# EAGLE board soundpuddle_megawing_mk2 (EAGLE 6.3), part 1 of 2
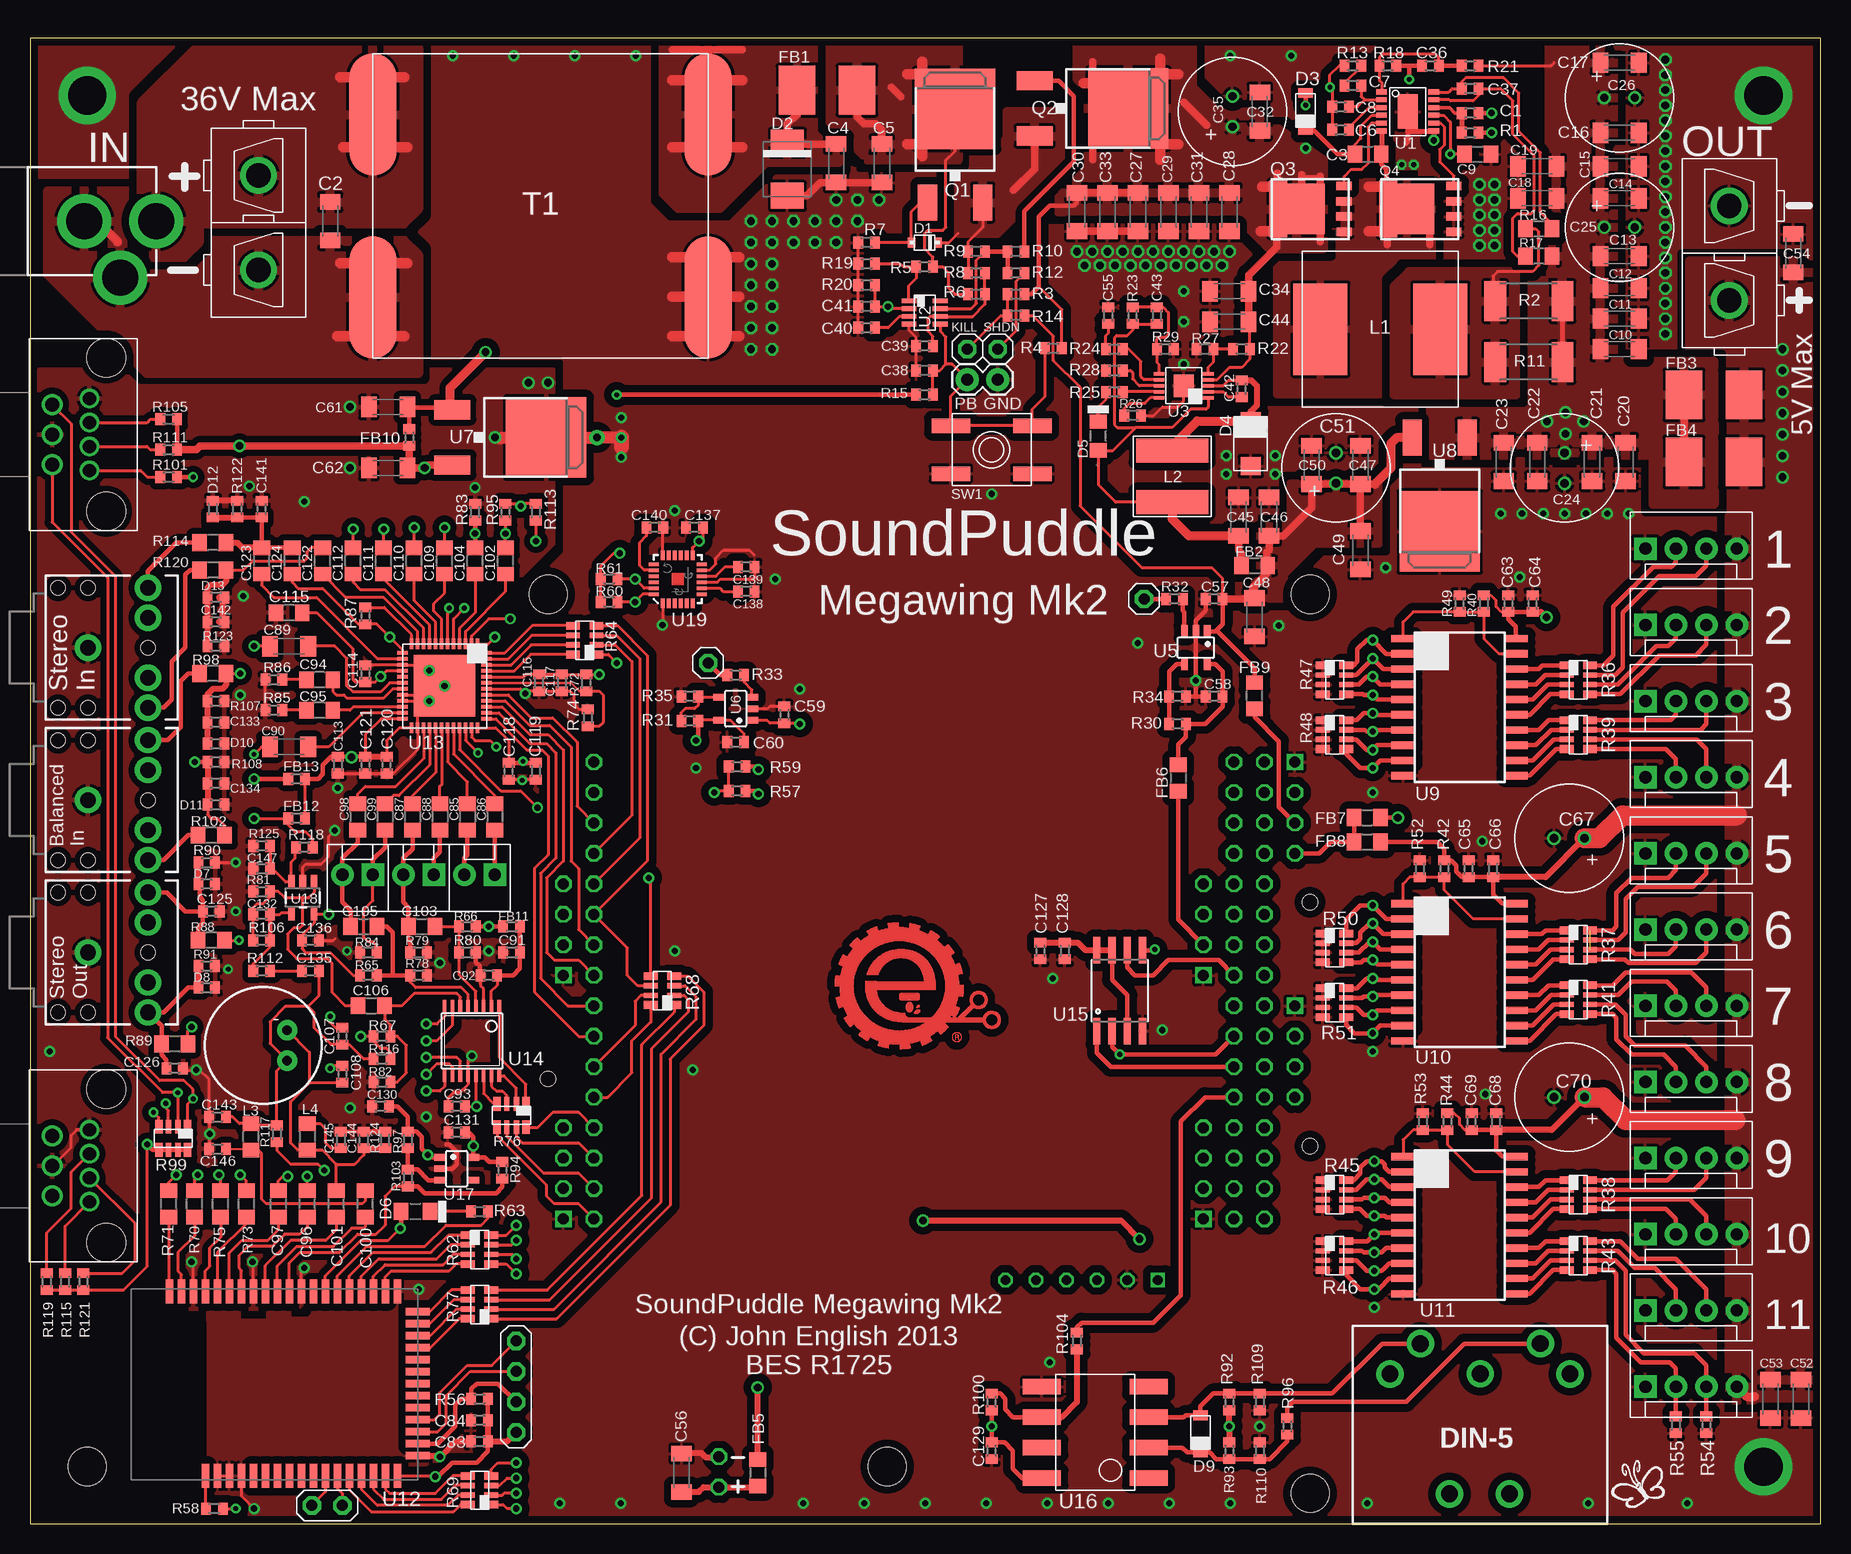
[diagram p5: board, top side]
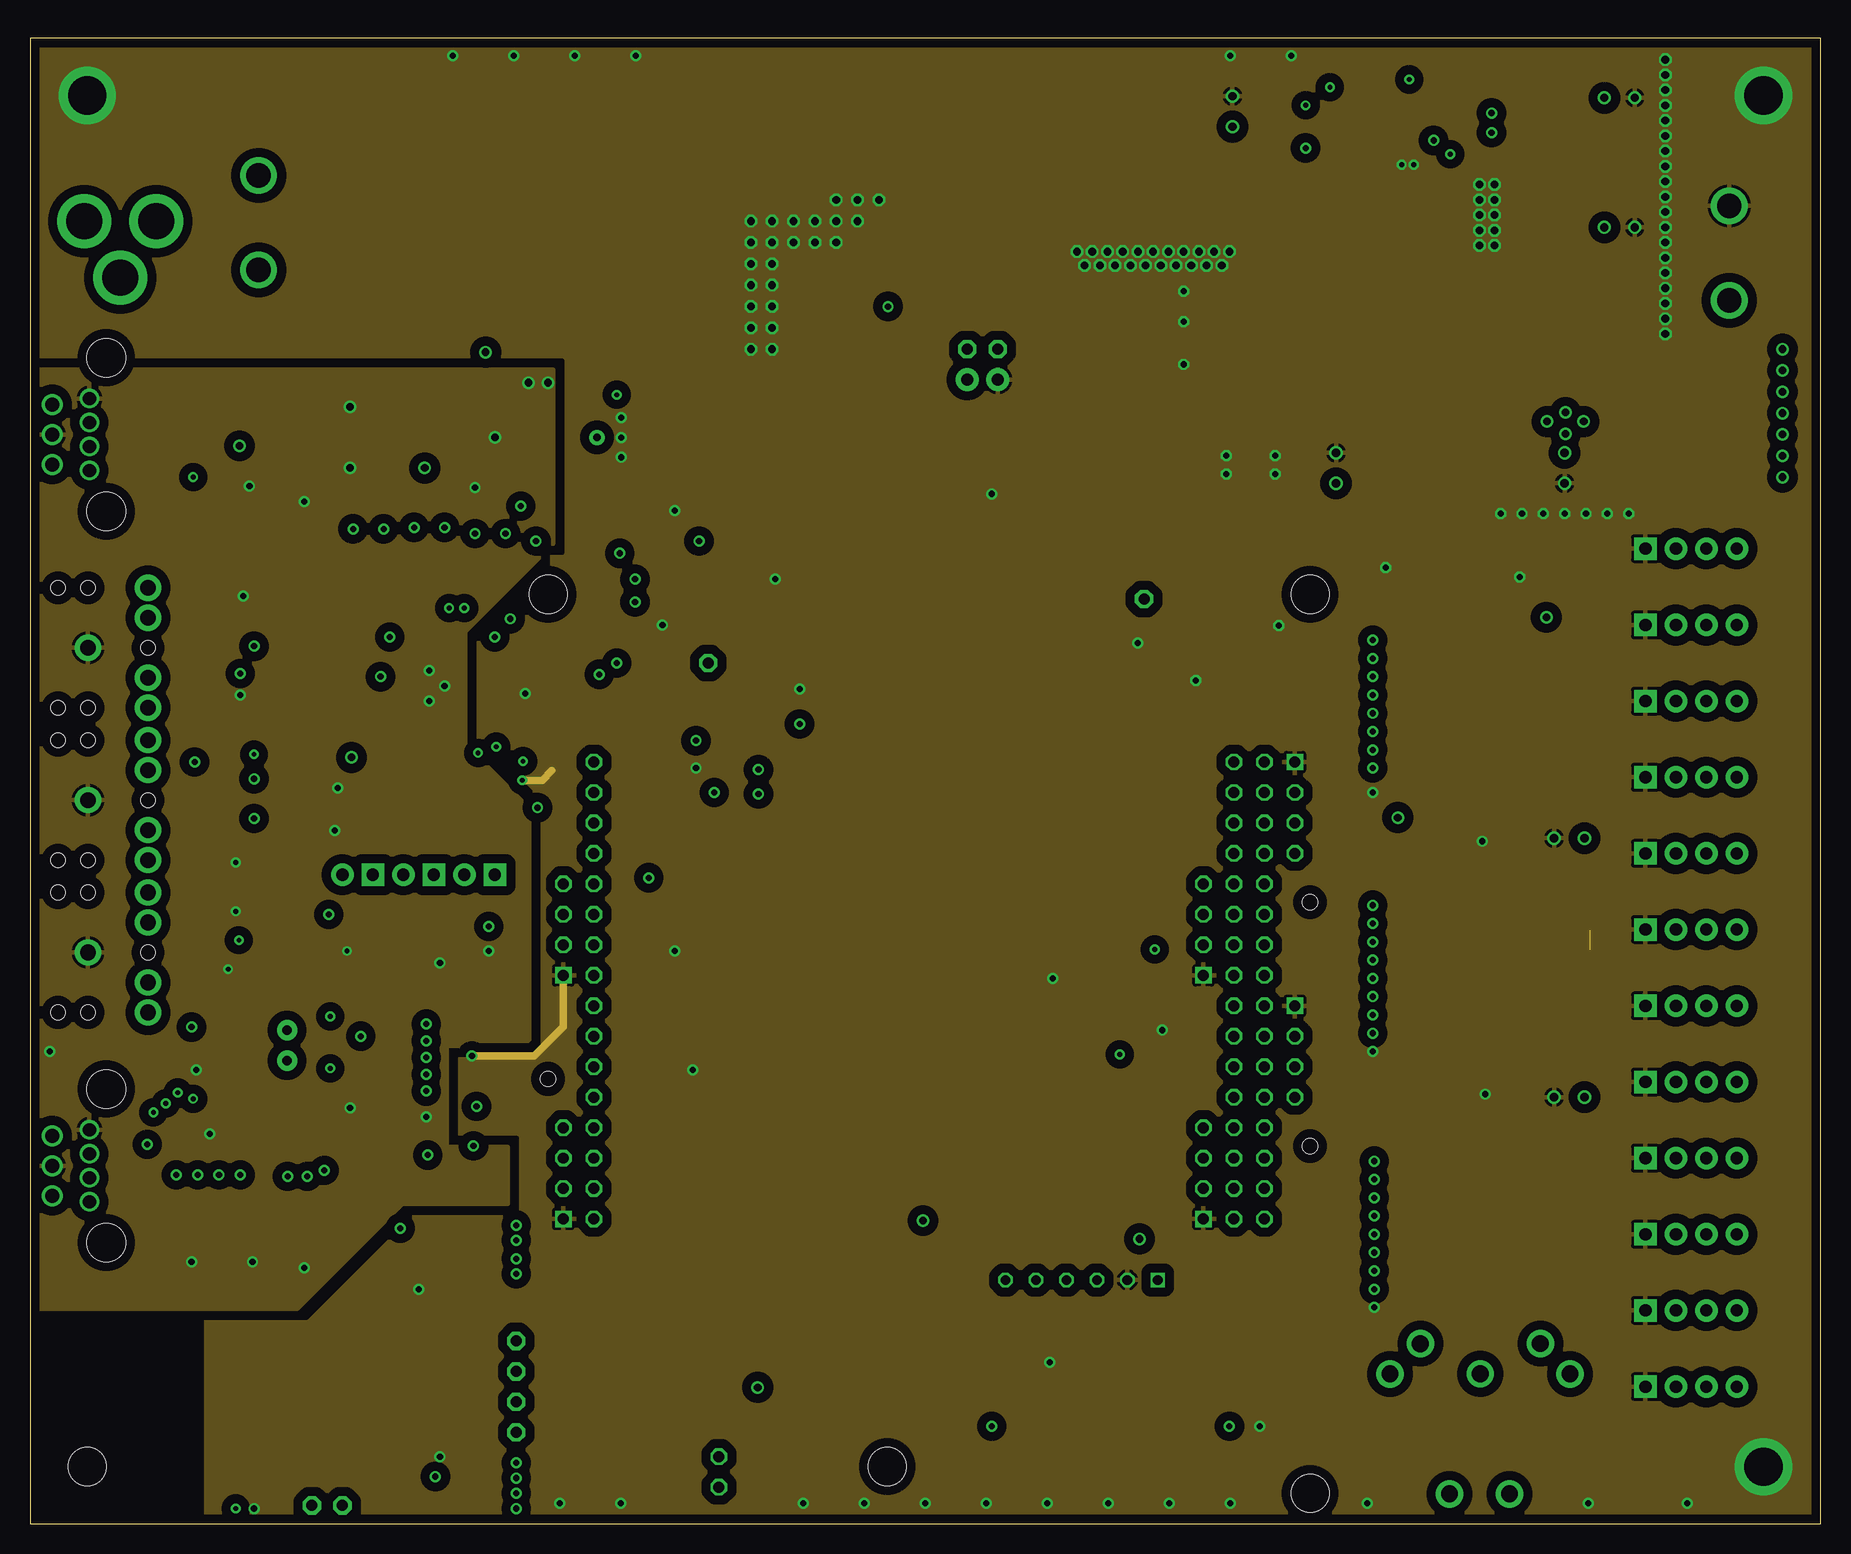
[diagram p6: board, inner layer GND]
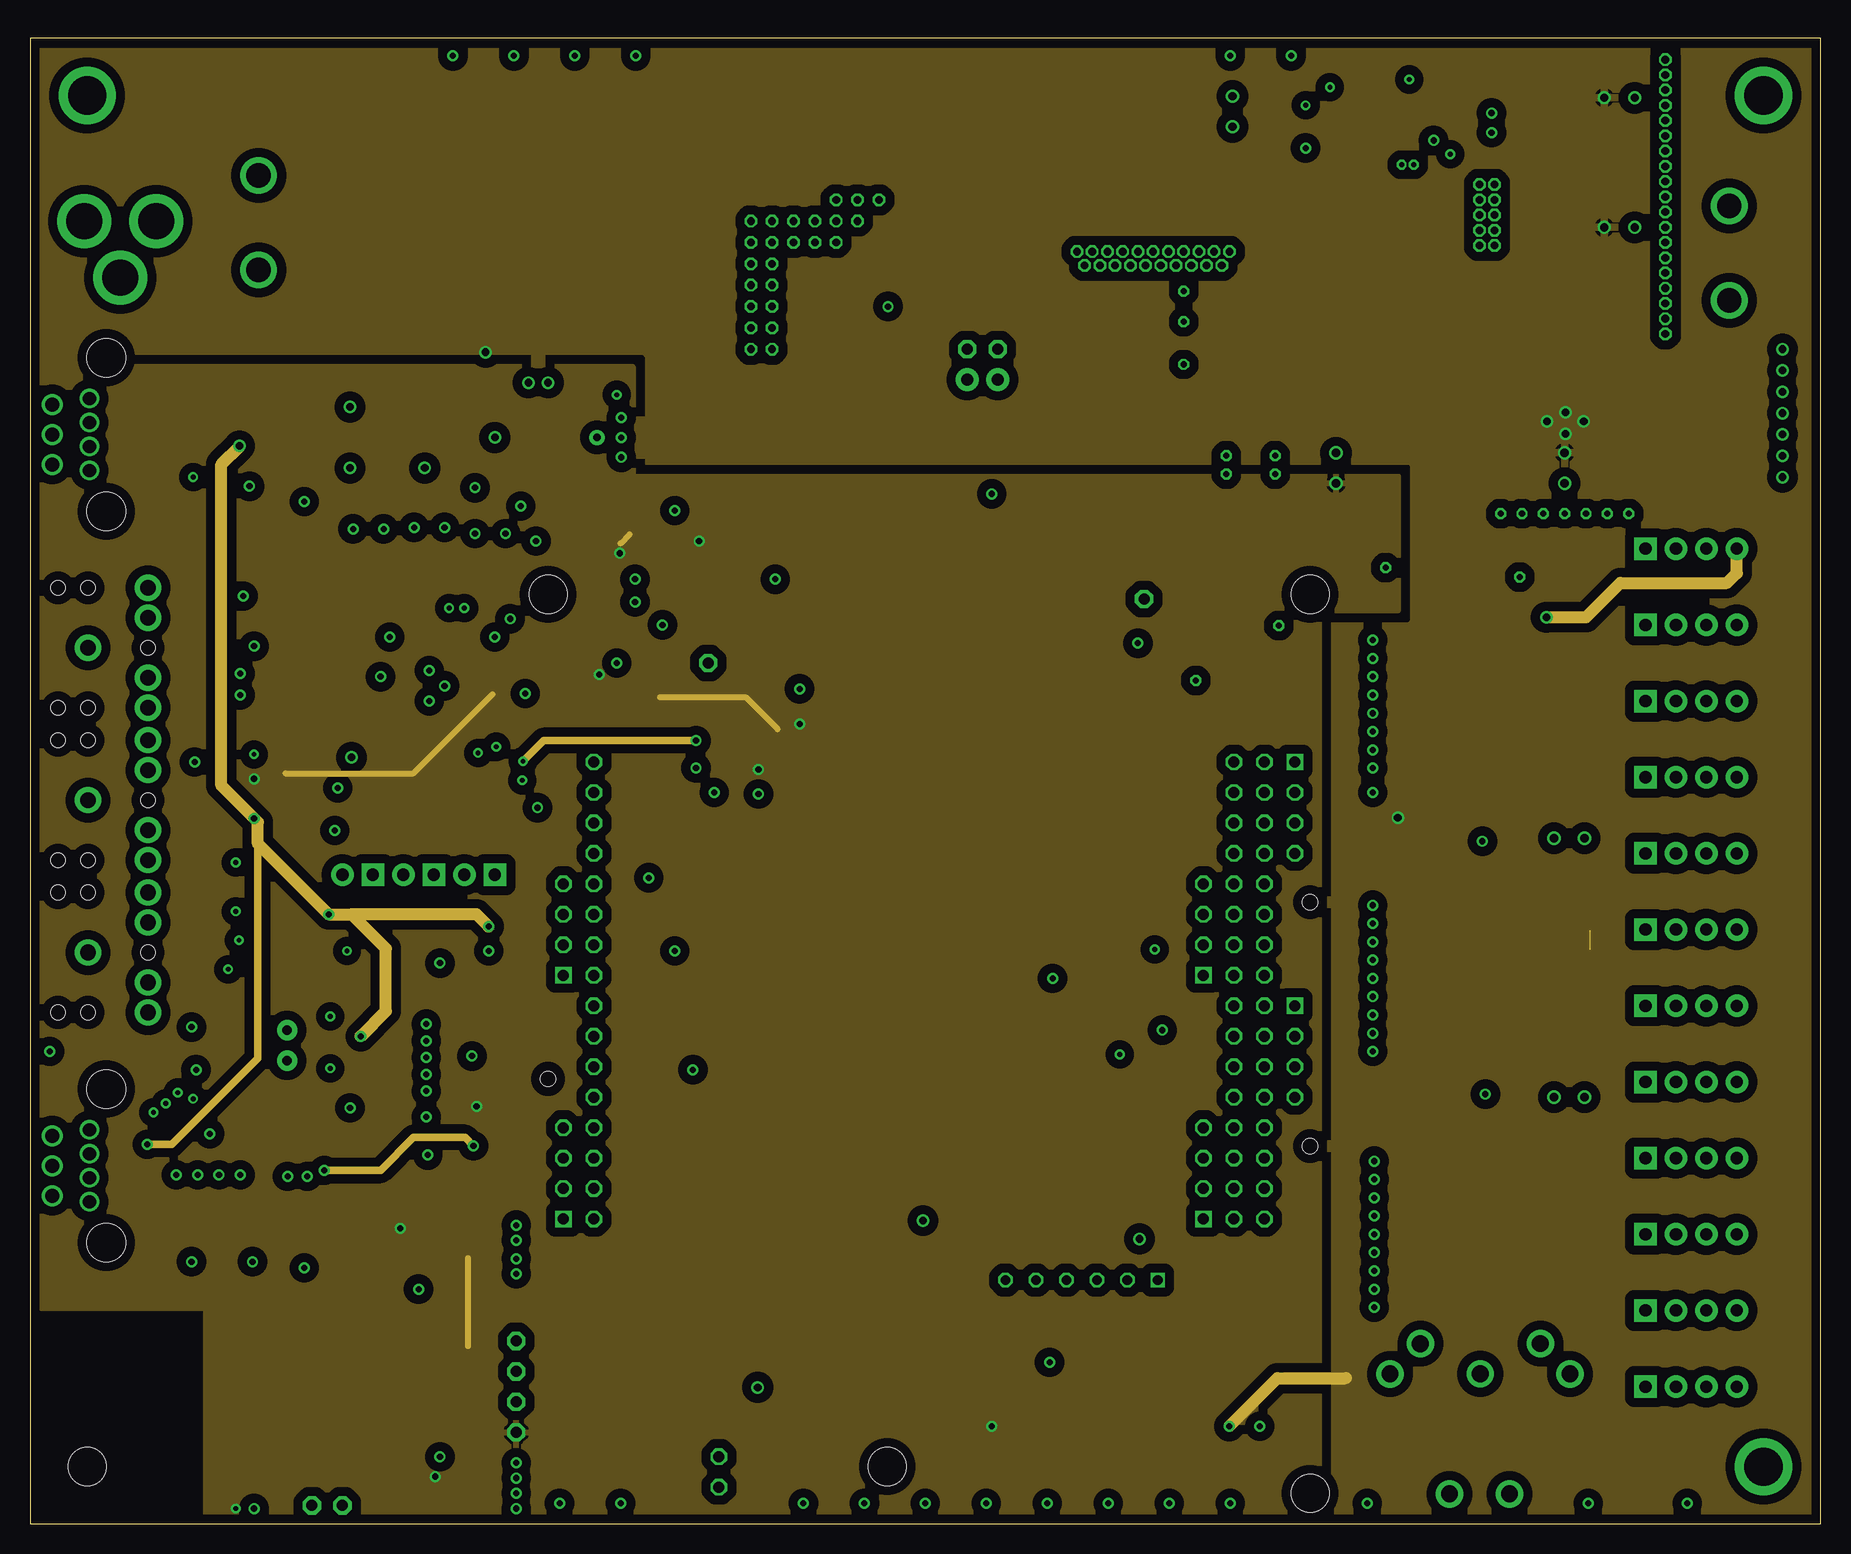
[diagram p7: board, inner layer PWR]
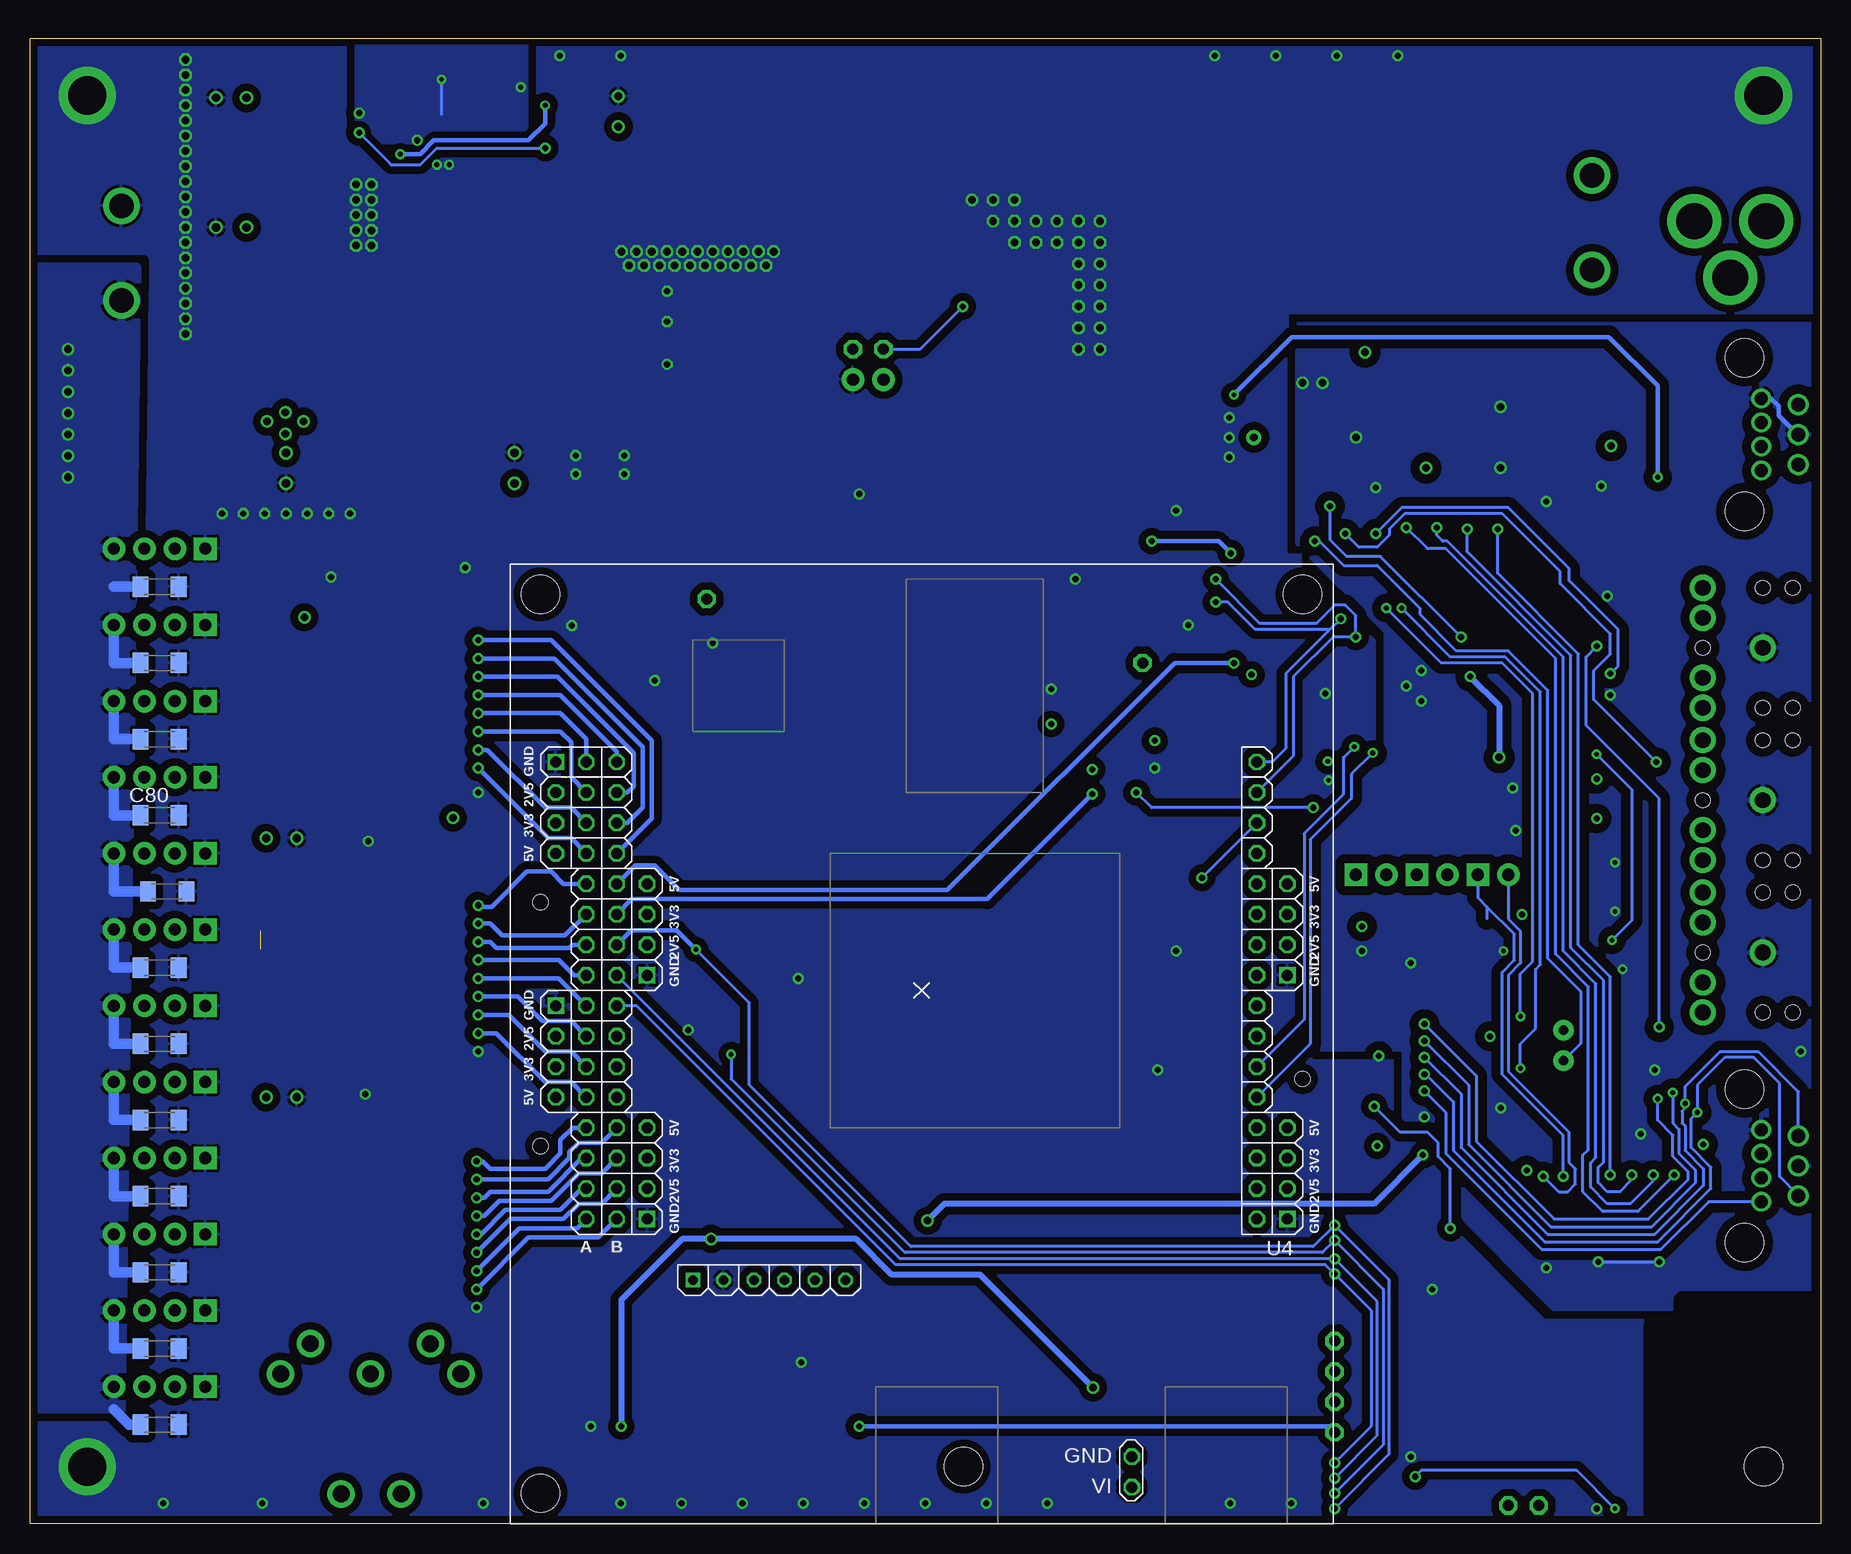
[diagram p8: board, bottom side, seen from below]

Size 149.22 x 123.83 mm. Coordinates in mm from the lower left corner, seen from the top.
Outline: 0,0 149.22,0 149.22,123.83 0,123.83 0,0
Copper layers (1+2*15+16): Top 0.0178mm / dielectric 12mil / GND 0.0356mm / dielectric 28mil / PWR 0.0356mm / dielectric 12mil / Bottom 0.0178mm
Design rules "SSC-EAGLE-4Lyr_v1.0.0.3 *": minimum track width 6mil, minimum drill 8mil, track to track 6mil, track to pad 6mil, pad to pad 6mil, via to via 6mil, smd to smd 6mil, copper to edge 20mil, drill to drill 16mil, minimum pad ring 8mil, minimum via ring 8mil, stop-mask expansion 3mil, vias tented up to drill 0mil, thermal gap 10mil
Net classes: 1 Power: width 0.813 mm, drill 0.381 mm, clearance 0.178 mm
Holes 3.17 mm at 71.44,4.76 4.76,4.76
tRestrict: area -0.4,1.6 to 11.5,18.6
bRestrict: area -0.4,1.6 to 11.5,18.6
vRestrict: area -0.4,1.6 to 11.5,18.6

## Footprints (pad centres in the part's own frame; a part is rotated, then mirrored left to right if it is on the bottom)
0603 = smd 0.8 x 1: 1 -0.7,0; 2 0.7,0
1206 = smd 1.3 x 1.7: P$1 -1.6,0; P$2 1.6,0
0805 = smd 1.2 x 1.4: 1 -1.1,0; 2 1.1,0
CAP_RADIAL_THRUHOLE_8MM_DIA = drill 0.7: P$1 0,-1.27; P$2 0,1.27
SOD-323 = smd 0.63 x 0.83: A 1.1,0; C -1.1,0
SMB = smd 2.159 x 2.743: P$1 -2.21,0; P$2 2.21,0
SOD-123F = smd 1.2 x 0.8: P$1 0,1.55; P$2 0,-1.55
DIODE_DO-214AC = smd 1.676 x 1.524: P$1 0,1.88; P$2 0,-1.88
LED_0805 = smd 1.2 x 1.4: 1 -1.2,0; 2 1.2,0
1612 = smd 3.055 x 4.06: 1 -2.5,0; 2 2.5,0
POWER_JACK_PTH = drill 2.997 pad 4.318: GND 0,7.7; GNDBREAK 4.7,10.7; PWR 0,13.7
ANDERSON_25A_VERTICAL_1P = drill 2.032: P$1 0,0
HEADER-SMALL-1PIN-0.036IN = drill 0.914 pad 1.524 octagon: P$1 0,0
1X02 = drill 1.016 pad 1.88: 1 0,0; 2 2.54,0
MOLEX-1X4 = drill 1.016 pad 1.88 square: 1 0,0 | drill 1.016 pad 1.88: 2 2.54,0; 3 5.08,0; 4 7.62,0
HEADER-SMALL-4PIN-0.036IN = drill 0.914 pad 1.524 octagon: P$1 0,0; P$2 2.54,0; P$3 5.08,0; P$4 7.62,0
MOLEX-1X2 = drill 1.016 pad 1.88 square: 1 0,0 | drill 1.016 pad 1.88: 2 2.54,0
HEADER-SMALL-2PIN-0.036IN = drill 0.914 pad 1.524 octagon: P$1 0,0; P$2 2.54,0
AUDIO-JACK = drill 1.3 pad 2.184: RING 5,5; RSH 5,2.5; SLEEVE 0,0; TIP 5,-5; TSH 5,-2.5 | hole 1.2: 0,5; -2.5,5; -2.5,-5; 0,-5; 5,0
DIN_5_FEMALE_SUPPORT = drill 1.4 pad 2.286: 1 0.46,3.61; 2 -7.07,3.6; 3 7.94,3.6; 4 -4.53,6.12; 5 5.47,6.13; 6 -2.1,-6.4; 7 2.9,-6.4
INDUCTOR_HC1 = smd 4.5 x 7.62: P$1 -5,0; P$2 5,0
INDUCTOR_6X6MM = smd 2 x 6: P$1 -2.15,0; P$2 2.15,0
MIC-9.7MM = drill 0.8 pad 1.676: 1 -2,1.27; 2 -2,-1.27
DPACK_1 = smd 1.6 x 3: 1 -2.3,-4.8; 3 2.3,-4.8 | smd 6.7 x 6.7: 2/HEAT 0,3
POWERPAK_SO-8_LFPAK = smd 1.25 x 0.7: 1S -2.825,1.905 | smd 1.27 x 0.7: 2S -2.825,0.635; 3S -2.825,-0.635; 4G -2.825,-1.905 | smd 4.6 x 4.2: PAD 1.1,0 | smd 1.5 x 4.7: PAD2 2.65,0
2512 = smd 1.8 x 3.3: 1 -2.8,0; 2 2.8,0
RESISTOR_ARRAY_1206_4CH_CRA06S = smd 0.63 x 1.15: P$1 -1.2,-0.975; P$4 1.2,-0.975; P$5 1.2,0.975; P$8 -1.2,0.975 | smd 0.44 x 1.15: P$2 -0.4,-0.975; P$3 0.4,-0.975; P$6 0.4,0.975; P$7 -0.4,0.975
EVQ-Q2 = smd 3.2 x 1.2: A -3.4,-2; A' 3.4,-2; B -3.4,2; B' 3.4,2
ROTARY_ENCODER_BOURNS_PEL12D = drill 1.097: 1 0,-3; 2 0,-1; 3 0,1; 4 0,3 | drill 1.168: A 3.1,-2.5; B 3.1,2.5; C 3.1,0 | hole 3.198: -1.4,-6.4; -1.4,6.4
CM-CHOKE_PULSE_BIG-FOOT = smd 3.937 x 10.16: P$1 -13.97,7.62; P$2 -13.97,-7.62; P$3 13.97,7.62; P$4 13.97,-7.62
MSOP12+1 = smd 0.42 x 0.889: P$1 -1.625,-2.17; P$2 -0.975,-2.17; P$3 -0.325,-2.17; P$4 0.325,-2.17; P$5 0.975,-2.17; P$6 1.625,-2.17; P$7 1.625,2.17; P$8 0.975,2.17; P$9 0.325,2.17; P$10 -0.325,2.17; P$11 -0.975,2.17; P$12 -1.625,2.17 | smd 2.845 x 1.651: P$13 0,0
TSOT-23-8 = smd 0.4 x 1.22: P$1 -0.975,-1.31; P$2 -0.325,-1.31; P$3 0.325,-1.31; P$4 0.975,-1.31; P$5 0.975,1.31; P$6 0.325,1.31; P$7 -0.325,1.31; P$8 -0.975,1.31
MSOP10+1_LT = smd 0.305 x 0.889: P$1 -1,-2.045; P$2 -0.5,-2.045; P$3 0,-2.045; P$4 0.5,-2.045; P$5 1,-2.045; P$6 1,2.045; P$7 0.5,2.045; P$8 0,2.045; P$9 -0.5,2.045; P$10 -1,2.045 | smd 1.88 x 1.68: P$11 0,0
PAPILIO_PLUS = drill 0.914 octagon: A0 27.94,-23.495; A1 27.94,-20.955; A2 27.94,-18.415; A3 27.94,-15.875; A4 27.94,-13.335; A5 27.94,-10.795; A6 27.94,-8.255; A7 27.94,-5.715; A8 27.94,-3.175; A9 27.94,-0.635; A10 27.94,1.905; A11 27.94,4.445; A12 27.94,6.985; A13 27.94,9.525; A14 27.94,12.065; A15 27.94,14.605; B0 25.4,14.605; B1 25.4,12.065; B2 25.4,9.525; B3 25.4,6.985; B4 25.4,4.445; B5 25.4,1.905; B6 25.4,-0.635; B7 25.4,-3.175; B8 25.4,-5.715; B9 25.4,-8.255; B10 25.4,-10.795; B11 25.4,-13.335; B12 25.4,-15.875; B13 25.4,-18.415; B14 25.4,-20.955; B15 25.4,-23.495; C0 -27.94,14.605; C1 -27.94,12.065; C2 -27.94,9.525; C3 -27.94,6.985; C4 -27.94,4.445; C5 -27.94,1.905; C6 -27.94,-0.635; C7 -27.94,-3.175; C8 -27.94,-5.715; C9 -27.94,-8.255; C10 -27.94,-10.795; C11 -27.94,-13.335; C12 -27.94,-15.875; C13 -27.94,-18.415; C14 -27.94,-20.955; C15 -27.94,-23.495; GND -17.526,34.417; VIN -17.526,36.957; W2_2V5 22.86,12.065; W2_2V5_2 30.48,-0.635; W2_2V5_3 22.86,-8.255; W2_2V5_4 30.48,-20.955; W2_3V3 22.86,9.525; W2_3V3_2 30.48,1.905; W2_3V3_3 22.86,-10.795; W2_3V3_4 30.48,-18.415; W2_5V 22.86,6.985; W2_5V_2 30.48,4.445; W2_5V_3 22.86,-13.335; W2_5V_4 30.48,-15.875; W3_2V5 -30.48,12.065; W3_2V5_2 -30.48,-8.255; W3_3V3 -30.48,9.525; W3_3V3_2 -30.48,-10.795; W3_5V -30.48,6.985; W3_5V_2 -30.48,-13.335 | drill 0.8 octagon: GND_2 16.51,19.685; TCK 13.97,19.685; TDI 8.89,19.685; TDO 11.43,19.685; TMS 6.35,19.685 | drill 0.8 square: REF 19.05,19.685 | drill 0.914 square: W2_GND 22.86,14.605; W2_GND_2 30.48,-3.175; W2_GND_3 22.86,-5.715; W2_GND_4 30.48,-23.495; W3_GND -30.48,14.605; W3_GND_2 -30.48,-5.715 | hole 3.175: 31.75,37.465; -31.75,-37.465; 31.75,-37.465 | hole 1.27: 31.75,-11.811; 31.75,8.509; -31.75,2.921
TSOT23 = smd 0.55 x 1.05: 1 -0.95,-1.35; 2 0,-1.35; 3 0.95,-1.35; 4 0.95,1.35; 5 -0.95,1.35
SOIC-20_TI_DW = smd 0.6 x 2: 1 -5.715,-4.7; 2 -4.445,-4.7; 3 -3.175,-4.7; 4 -1.905,-4.7; 5 -0.635,-4.7; 6 0.635,-4.7; 7 1.905,-4.7; 8 3.175,-4.7; 9 4.445,-4.7; 10 5.715,-4.7; 11 5.715,4.7; 12 4.445,4.7; 13 3.175,4.7; 14 1.905,4.7; 15 0.635,4.7; 16 -0.635,4.7; 17 -1.905,4.7; 18 -3.175,4.7; 19 -4.445,4.7; 20 -5.715,4.7
WT32_BT_MODULE = smd 2 x 0.6: 1 -7.7,6.97; 2 -7.7,5.97; 3 -7.7,4.97; 4 -7.7,3.97; 5 -7.7,2.97; 6 -7.7,1.97; 7 -7.7,0.97; 8 -7.7,-0.03; 9 -7.7,-1.03; 10 -7.7,-2.03; 11 -7.7,-3.03; 12 -7.7,-4.03; 13 -7.7,-5.03; 14 -7.7,-6.03; 15 -7.7,-7.03; 16 -7.7,-8.03; 17 -7.7,-9.03; 31 7.7,-9.03; 32 7.7,-8.03; 33 7.7,-7.03; 34 7.7,-6.03; 35 7.7,-5.03; 36 7.7,-4.03; 37 7.7,-3.03; 38 7.7,-2.03; 39 7.7,-1.03; 40 7.7,-0.03; 41 7.7,0.97; 42 7.7,1.97; 43 7.7,2.97; 44 7.7,3.97; 45 7.7,4.97; 46 7.7,5.97; 47 7.7,6.97; 48 7.7,7.97; 49 7.7,8.97; 50 7.7,9.97 | smd 0.6 x 2: 18 -6,-10.73; 19 -5,-10.73; 20 -4,-10.73; 21 -3,-10.73; 22 -2,-10.73; 23 -1,-10.73; 24 0,-10.73; 25 1,-10.73; 26 2,-10.73; 27 3,-10.73; 28 4,-10.73; 29 5,-10.73; 30 6,-10.73
QFN48+1 = smd 0.85 x 0.28: P$1 -3.5,2.75; P$2 -3.5,2.25; P$3 -3.5,1.75; P$4 -3.5,1.25; P$5 -3.5,0.75; P$6 -3.5,0.25; P$7 -3.5,-0.25; P$8 -3.5,-0.75; P$9 -3.5,-1.25; P$10 -3.5,-1.75; P$11 -3.5,-2.25; P$12 -3.5,-2.75; P$25 3.5,-2.75; P$26 3.5,-2.25; P$27 3.5,-1.75; P$28 3.5,-1.25; P$29 3.5,-0.75; P$30 3.5,-0.25; P$31 3.5,0.25; P$32 3.5,0.75; P$33 3.5,1.25; P$34 3.5,1.75; P$35 3.5,2.25; P$36 3.5,2.75 | smd 0.28 x 0.85: P$13 -2.75,-3.5; P$14 -2.25,-3.5; P$15 -1.75,-3.5; P$16 -1.25,-3.5; P$17 -0.75,-3.5; P$18 -0.25,-3.5; P$19 0.25,-3.5; P$20 0.75,-3.5; P$21 1.25,-3.5; P$22 1.75,-3.5; P$23 2.25,-3.5; P$24 2.75,-3.5; P$37 2.75,3.5; P$38 2.25,3.5; P$39 1.75,3.5; P$40 1.25,3.5; P$41 0.75,3.5; P$42 0.25,3.5; P$43 -0.25,3.5; P$44 -0.75,3.5; P$45 -1.25,3.5; P$46 -1.75,3.5; P$47 -2.25,3.5; P$48 -2.75,3.5 | smd 5.15 x 5.15: PAD 0,0
TSSOP16 = smd 0.305 x 0.991: 1 -2.275,-2.918; 2 -1.625,-2.918; 3 -0.975,-2.918; 4 -0.325,-2.918; 5 0.325,-2.918; 6 0.975,-2.918; 7 1.625,-2.918; 8 2.275,-2.918; 9 2.275,2.918; 10 1.625,2.918; 11 0.975,2.918; 12 0.325,2.918; 13 -0.325,2.918; 14 -0.975,2.918; 15 -1.625,2.918; 16 -2.275,2.918
SO08-EIAJ = smd 0.61 x 2.21: 1 -1.905,-3.378; 2 -0.635,-3.378; 3 0.635,-3.378; 4 1.905,-3.378; 5 1.905,3.353; 6 0.635,3.353; 7 -0.635,3.353; 8 -1.905,3.353
SMD-8 = smd 1.27 x 3.175: P$1 -3.81,-4.445; P$2 -1.27,-4.445; P$3 1.27,-4.445; P$4 3.81,-4.445; P$5 3.81,4.445; P$6 1.27,4.445; P$7 -1.27,4.445; P$8 -3.81,4.445
SOT23-5 = smd 0.55 x 1.2: 1 -0.95,-1.3; 2 0,-1.3; 3 0.95,-1.3; 4 0.95,1.3; 5 -0.95,1.3
QFN-24 = smd 0.8 x 0.3: 1 -2,1.25; 2 -2,0.75; 3 -2,0.25; 4 -2,-0.25; 5 -2,-0.75; 6 -2,-1.25; 13 2,-1.25; 14 2,-0.75; 15 2,-0.25; 16 2,0.25; 17 2,0.75; 18 2,1.25 | smd 0.3 x 0.8: 7 -1.25,-2; 8 -0.75,-2; 9 -0.25,-2; 10 0.25,-2; 11 0.75,-2; 12 1.25,-2; 19 1.25,2; 20 0.75,2; 21 0.25,2; 22 -0.25,2; 23 -0.75,2; 24 -1.25,2

## Placement (x,y rotation side)
C1  4.7uF  [0603]  120.02,117.6 0 top
C2  10uF  [1206]  25.02,108.59 270 top
C3  0.1uF  [0805]  111.51,114.17 0 top
C4  10uF  [1206]  67.18,113.41 270 top
C5  10uF  [1206]  70.99,113.41 270 top
C6  0.1uF  [0603]  109.22,116.2 180 top
C7  2.2nF  [0603]  110.24,119.89 180 top
C8  100pF  [0603]  109.22,118.11 180 top
C9  10uF  [0805]  120.65,114.17 0 top
C10  47uF  [1206]  132.46,97.92 0 top
C11  47uF  [1206]  132.46,100.46 0 top
C12  47uF  [1206]  132.46,103 0 top
C13  47uF  [1206]  132.46,105.66 0 top
C14  47uF  [1206]  132.46,110.49 0 top
C15  47uF  [1206]  132.46,113.16 0 top
C16  47uF  [1206]  132.46,115.95 0 top
C17  47uF  [1206]  132.46,121.79 0 top
C18  47uF  [1206]  125.6,110.49 180 top
C19  47uF  [1206]  125.6,113.16 180 top
C20  47uF  [1206]  132.97,88.52 270 top
C21  47uF  [1206]  130.18,88.52 270 top
C22  47uF  [1206]  125.6,88.52 270 top
C23  47uF  [1206]  122.81,88.52 270 top
C24  270uF/16V  [CAP_RADIAL_THRUHOLE_8MM_DIA]  127.89,88.01 0 top
C25  270uF/16V  [CAP_RADIAL_THRUHOLE_8MM_DIA]  132.46,108.08 90 top
C26  270uF/16V  [CAP_RADIAL_THRUHOLE_8MM_DIA]  132.46,118.87 90 top
C27  10uF  [1206]  92.33,109.35 270 top
C28  10uF  [1206]  99.95,109.35 270 top
C29  10uF  [1206]  94.87,109.35 270 top
C30  10uF  [1206]  87.25,109.35 270 top
C31  10uF  [1206]  97.41,109.35 270 top
C32  10uF  [1206]  102.49,117.73 90 top
C33  10uF  [1206]  89.79,109.35 270 top
C34  10uF  [1206]  99.95,102.74 180 top
C35  180uF/50V  [CAP_RADIAL_THRUHOLE_8MM_DIA]  100.2,117.73 180 top
C36  100pF  [0603]  116.71,121.54 0 top
C37  2.2nF  [0603]  120.02,119.63 0 top
C38  0.1uF  [0603]  74.55,96.14 180 top
C39  0.1uF  [0603]  74.55,98.17 180 top
C40  0.1uF  [0603]  69.72,99.69 180 top
C41  0.1uF  [0603]  69.72,101.47 180 top
C42  1uF  [0603]  100.97,94.62 90 top
C43  DNP  [0603]  93.92,100.71 90 top
C44  10uF  [1206]  99.95,100.2 180 top
C45  10uF  [1206]  100.71,83.95 90 top
C46  10uF  [1206]  103.25,83.95 90 top
C47  10uF  [1206]  110.87,88.27 90 top
C48  10uF  [1206]  102.04,75.56 270 top
C49  10uF  [1206]  110.87,81.15 270 top
C50  10uF  [1206]  106.81,88.27 90 top
C51  270uF/16V  [CAP_RADIAL_THRUHOLE_8MM_DIA]  108.84,88.01 180 top
C52  47uF  [1206]  147.57,10.41 270 top
C53  47uF  [1206]  145.03,10.41 270 top
C54  47uF  [1206]  146.94,105.92 90 top
C55  2.2nF  [0603]  89.85,100.71 90 top
C56  10uF  [1206]  54.29,4.25 90 top
C57  1uF  [0603]  98.68,77.09 180 top
C58  1uF  [0603]  98.68,68.96 180 top
C59  1uF  [0603]  62.86,67.44 90 top
C60  1uF  [0603]  58.8,65.15 180 top
C61  10uF  [1206]  29.84,93.09 180 top
C62  10uF  [1206]  29.84,88.01 180 top
C63  10uF  [0603]  123.19,76.71 90 top
C64  1uF  [0603]  125.22,76.71 90 top
C65  10uF  [0603]  119.89,54.61 90 top
C66  1uF  [0603]  121.92,54.61 90 top
C67  270uF/16V  [CAP_RADIAL_THRUHOLE_8MM_DIA]  128.27,57.15 270 top
C68  1uF  [0603]  122.17,33.53 90 top
C69  1uF  [0603]  120.14,33.53 90 top
C70  270uF/16V  [CAP_RADIAL_THRUHOLE_8MM_DIA]  128.27,35.56 270 top
C71  47uF  [1206]  138.43,78.11 0 bottom
C72  47uF  [1206]  137.79,52.7 0 bottom
C73  47uF  [1206]  138.43,27.3 0 bottom
C74  47uF  [1206]  138.43,71.75 0 bottom
C75  47uF  [1206]  138.43,46.36 0 bottom
C76  47uF  [1206]  138.43,20.95 0 bottom
C77  47uF  [1206]  138.43,65.41 0 bottom
C78  47uF  [1206]  138.43,40.01 0 bottom
C79  47uF  [1206]  138.43,14.61 0 bottom
C80  47uF  [1206]  138.43,59.05 0 bottom
C81  47uF  [1206]  138.43,33.66 0 bottom
C82  47uF  [1206]  138.43,8.26 0 bottom
C83  0.1uF  [0603]  37.46,6.86 180 top
C84  1uF  [0603]  37.46,8.64 180 top
C85  0.47uF  [0805]  36.45,58.93 270 top
C86  0.47uF  [0805]  38.73,58.93 270 top
C87  0.47uF  [0805]  31.88,58.93 270 top
C88  0.47uF  [0805]  34.16,58.93 270 top
C89  47uF  [1206]  21.59,73.15 180 top
C90  47uF  [1206]  21.59,64.77 180 top
C91  0.1uF  [0603]  40.13,47.62 180 top
C92  1uF  [0603]  38.23,45.72 180 top
C93  0.1uF  [0603]  35.56,34.8 180 top
C94  0.47uF  [0805]  24.13,70.36 180 top
C95  0.47uF  [0805]  24.13,67.82 180 top
C96  0.47uF  [0805]  23.11,26.67 90 top
C97  0.47uF  [0805]  20.7,26.67 90 top
C98  0.47uF  [0805]  27.3,58.93 270 top
C99  0.47uF  [0805]  29.59,58.93 270 top
C100  0.47uF  [0805]  27.94,26.67 90 top
C101  0.47uF  [0805]  25.53,26.67 90 top
C102  0.1uF  [0805]  39.62,80.26 90 top
C103  10uF  [0805]  32.64,49.78 0 top
C104  0.1uF  [0805]  37.08,80.26 90 top
C105  10uF  [0805]  27.81,49.78 0 top
C106  10uF  [0805]  28.45,43.18 0 top
C107  0.1uF  [0603]  26.03,40.64 270 top
C108  0.1uF  [0603]  26.03,37.47 270 top
C109  0.47uF  [0805]  34.54,80.26 90 top
C110  0.47uF  [0805]  32,80.26 90 top
C111  0.47uF  [0805]  29.46,80.26 90 top
C112  0.47uF  [0805]  26.92,80.26 90 top
C113  0.1uF  [0603]  25.65,63.25 270 top
C114  1uF  [0603]  27.94,70.87 90 top
C115  10uF  [0805]  21.59,75.95 180 top
C116  0.1uF  [0603]  42.42,70.1 270 top
C117  1uF  [0603]  44.32,70.1 270 top
C118  0.1uF  [0603]  39.88,62.74 270 top
C119  1uF  [0603]  42.16,62.74 270 top
C120  0.1uF  [0603]  29.72,63.25 270 top
C121  1uF  [0603]  27.94,63.25 270 top
C122  0.47uF  [0805]  24.38,80.26 90 top
C123  0.47uF  [0805]  19.3,80.26 90 top
C124  0.47uF  [0805]  21.84,80.26 90 top
C125  47pF  [0603]  15.11,51.05 0 top
C126  47pF  [0603]  12.06,37.97 0 top
C127  1uF  [0603]  84.2,47.75 270 top
C128  1uF  [0603]  86.23,47.75 270 top
C129  1uF  [0603]  80.14,6.1 270 top
C130  1uF  [0603]  29.21,34.8 180 top
C131  1uF  [0603]  35.56,32.64 180 top
C132  100pF  [0603]  19.3,50.8 0 top
C133  47pF  [0603]  15.49,66.8 0 top
C134  47pF  [0603]  15.49,61.72 0 top
C135  1uF  [0603]  23.37,46.1 0 top
C136  1uF  [0603]  23.37,48.64 0 top
C137  0.1uF  [0603]  55.37,83.06 180 top
C138  10nF  [0603]  59.69,77.72 0 top
C139  0.1uF  [0603]  59.69,79.76 0 top
C140  2.2nF  [0603]  52.07,83.06 0 top
C141  47pF  [0603]  19.3,84.58 90 top
C142  47pF  [0603]  15.49,75.18 0 top
C143  15pF  [0603]  15.62,33.91 180 top
C144  15pF  [0603]  27.81,32 90 top
C145  15pF  [0603]  25.91,32 90 top
C146  15pF  [0603]  15.62,31.24 180 top
C147  1uF  [0603]  19.3,54.61 180 top
D1  [SOD-323]  74.55,106.81 180 top
D2  40V  [SMB]  63.12,112.9 270 top
D3  1A  [SOD-123F]  106.3,117.73 180 top
D4  2A  [DIODE_DO-214AC]  101.73,90.04 0 top
D5  [LED_0805]  89.03,90.68 90 top
D6  [LED_0805]  32.13,26.04 0 top
D7  5V  [0603]  14.73,53.34 0 top
D8  5V  [0603]  14.73,44.7 0 top
D9  1A  [SOD-123F]  97.54,7.49 180 top
D10  5V  [0603]  15.49,65.02 0 top
D11  5V  [0603]  15.49,59.94 0 top
D12  5V  [0603]  15.24,84.58 90 top
D13  5V  [0603]  15.49,77.22 0 top
FB1  10A  [1612]  66.42,119.51 0 top
FB2  2.5A  [0805]  102.04,79.88 0 top
FB3  10A  [1612]  140.33,94.11 180 top
FB4  10A  [1612]  140.33,88.52 180 top
FB5  2.5A  [0805]  60.64,4.25 270 top
FB6  2.5A  [0805]  95.69,62.17 270 top
FB7  2.5A  [0805]  111.44,58.86 0 top
FB8  2.5A  [0805]  111.44,56.83 0 top
FB9  2.5A  [0805]  102.04,69.02 90 top
FB10  DNP  [0603]  31.62,90.55 270 top
FB11  1A  [0603]  40.13,49.78 180 top
FB12  1A  [0603]  22.22,58.8 0 top
FB13  DNP  [0603]  22.22,62.1 0 top
J1  POWER_JACKPTH  [POWER_JACK_PTH]  -3.17,108.59 270 top
JP1  ANDERSON_POWERPOLEVERTICAL  [ANDERSON_25A_VERTICAL_1P]  19.05,112.4 90 top
JP2  ANDERSON_POWERPOLEVERTICAL  [ANDERSON_25A_VERTICAL_1P]  19.05,104.52 90 top
JP3  HEADER-SMALL-1PIN  [HEADER-SMALL-1PIN-0.036IN]  80.64,97.92 0 top
JP4  HEADER-SMALL-1PIN  [HEADER-SMALL-1PIN-0.036IN]  78.11,97.92 0 top
JP5  [1X02]  78.11,95.38 0 top
JP6  ANDERSON_POWERPOLEVERTICAL  [ANDERSON_25A_VERTICAL_1P]  141.61,101.98 270 top
JP7  ANDERSON_POWERPOLEVERTICAL  [ANDERSON_25A_VERTICAL_1P]  141.61,109.86 270 top
JP8  HEADER-SMALL-1PIN  [HEADER-SMALL-1PIN-0.036IN]  92.84,77.09 0 top
JP9  HEADER-SMALL-1PIN  [HEADER-SMALL-1PIN-0.036IN]  56.52,71.75 0 top
JP10  [MOLEX-1X4]  134.62,81.28 0 top
JP11  [MOLEX-1X4]  134.62,55.88 0 top
JP12  [MOLEX-1X4]  134.62,30.48 0 top
JP13  [MOLEX-1X4]  134.62,74.93 0 top
JP14  [MOLEX-1X4]  134.62,49.53 0 top
JP15  [MOLEX-1X4]  134.62,24.13 0 top
JP16  [MOLEX-1X4]  134.62,68.58 0 top
JP17  [MOLEX-1X4]  134.62,43.18 0 top
JP18  [MOLEX-1X4]  134.62,17.78 0 top
JP19  [MOLEX-1X4]  134.62,62.23 0 top
JP20  [MOLEX-1X4]  134.62,36.83 0 top
JP21  [MOLEX-1X4]  134.62,11.43 0 top
JP22  HEADER-SMALL-4PIN0.1IN  [HEADER-SMALL-4PIN-0.036IN]  40.51,15.24 270 top
JP23  [MOLEX-1X2]  38.73,54.1 180 top
JP24  [MOLEX-1X2]  33.65,54.1 180 top
JP25  [MOLEX-1X2]  28.57,54.1 180 top
JP26  HEADER-SMALL-2PIN0.1IN  [HEADER-SMALL-2PIN-0.036IN]  23.49,1.52 0 top
JP27  AUDIO-JACK2PTH  [AUDIO-JACK]  4.83,47.62 0 top
JP28  AUDIO-JACK2PTH  [AUDIO-JACK]  4.83,60.33 0 top
JP29  MIDI_CONN_FEMALE_SUPPORT  [DIN_5_FEMALE_SUPPORT]  120.4,8.89 0 top
JP30  AUDIO-JACK2PTH  [AUDIO-JACK]  4.83,73.03 0 top
L1  2.2uH  [INDUCTOR_HC1]  112.52,99.57 0 top
L2  4.7uH  [INDUCTOR_6X6MM]  95.19,87.31 270 top
L3  15nH  [0805]  18.41,32.26 90 top
L4  15nH  [0805]  23.11,32.26 270 top
LOGO  LOGO  [LOGO]  66.36,39.05 0 top
MIC1  MIC9.7MM  [MIC-9.7MM]  19.43,39.88 180 top
Q1  MOSFET-P_CHANNELDPACK  [DPACK_1]  77.09,114.94 0 top
Q2  MOSFET-P_CHANNELDPACK  [DPACK_1]  88.52,117.98 270 top
Q3  [POWERPAK_SO-8_LFPAK]  106.68,109.6 180 top
Q4  [POWERPAK_SO-8_LFPAK]  115.82,109.6 180 top
R1  2  [0603]  120.02,115.95 180 top
R2  DNP  [2512]  124.9,101.92 180 top
R3  DNP  [0603]  82.17,102.49 0 top
R4  DNP  [0603]  85.28,97.98 0 top
R5  DNP  [0603]  74.55,104.78 0 top
R6  1K  [0603]  78.87,102.49 180 top
R7  100K  [0603]  69.72,106.81 0 top
R8  DNP  [0603]  78.87,104.27 180 top
R9  100K  [0603]  78.87,106.05 180 top
R10  100K  [0603]  82.17,106.05 0 top
R11  0.002  [2512]  124.9,96.84 180 top
R12  DNP  [0603]  82.17,104.27 0 top
R13  7.5K  [0603]  110.24,121.54 0 top
R14  100K  [0603]  82.17,100.71 0 top
R15  1K  [0603]  74.55,94.11 0 top
R16  16  [0805]  125.73,107.95 0 top
R17  16  [0805]  125.73,105.66 180 top
R18  8.06K  [0603]  113.16,121.54 0 top
R19  1K  [0603]  69.72,105.03 0 top
R20  DNP  [0603]  69.72,103.25 0 top
R21  42.2K  [0603]  120.02,121.54 180 top
R22  10K  [0603]  100.97,97.92 0 top
R23  0  [0603]  91.88,100.71 270 top
R24  100K  [0603]  90.36,97.9 0 top
R25  1K  [0603]  90.36,94.35 180 top
R26  10K  [0603]  91.88,92.39 180 top
R27  10K  [0603]  97.92,97.92 0 top
R28  49.9K  [0603]  90.36,96.13 0 top
R29  DNP  [0603]  94.61,97.92 180 top
R30  DNP  [0603]  95.63,66.67 0 top
R31  DNP  [0603]  54.99,66.93 0 top
R32  10K  [0603]  95.38,77.09 0 top
R33  10K  [0603]  58.8,70.74 0 top
R34  DNP  [0603]  95.63,68.96 180 top
R35  DNP  [0603]  54.99,68.96 0 top
R36  22  [RESISTOR_ARRAY_1206_4CH_CRA06S]  129.03,70.36 270 top
R37  22  [RESISTOR_ARRAY_1206_4CH_CRA06S]  129.03,48.26 270 top
R38  22  [RESISTOR_ARRAY_1206_4CH_CRA06S]  129.03,27.43 270 top
R39  22  [RESISTOR_ARRAY_1206_4CH_CRA06S]  129.03,65.79 270 top
R40  DNP  [0603]  121.16,76.71 90 top
R41  22  [RESISTOR_ARRAY_1206_4CH_CRA06S]  129.03,43.69 270 top
R42  DNP  [0603]  117.86,54.61 90 top
R43  22  [RESISTOR_ARRAY_1206_4CH_CRA06S]  129.03,22.35 270 top
R44  DNP  [0603]  118.11,33.53 90 top
R45  DNP  [RESISTOR_ARRAY_1206_4CH_CRA06S]  108.71,27.43 270 top
R46  DNP  [RESISTOR_ARRAY_1206_4CH_CRA06S]  108.71,22.35 270 top
R47  DNP  [RESISTOR_ARRAY_1206_4CH_CRA06S]  108.71,70.36 270 top
R48  DNP  [RESISTOR_ARRAY_1206_4CH_CRA06S]  108.71,65.79 270 top
R49  2.2K  [0603]  119.13,76.71 270 top
R50  DNP  [RESISTOR_ARRAY_1206_4CH_CRA06S]  108.71,48.01 270 top
R51  DNP  [RESISTOR_ARRAY_1206_4CH_CRA06S]  108.71,43.43 270 top
R52  2.2K  [0603]  115.82,54.61 270 top
R53  2.2K  [0603]  116.08,33.53 270 top
R54  562K  [0603]  139.7,8.26 90 top
R55  562K  [0603]  137.16,8.26 90 top
R56  2.2K  [0603]  37.46,10.41 0 top
R57  1K  [0603]  58.93,61.09 180 top
R58  100K  [0603]  15.37,1.27 0 top
R59  10K  [0603]  58.93,63.12 180 top
R60  2.2K  [0603]  48.26,76.84 0 top
R61  2.2K  [0603]  48.26,78.74 0 top
R62  22  [RESISTOR_ARRAY_1206_4CH_CRA06S]  37.46,22.86 270 top
R63  2.2K  [0603]  37.46,26.04 180 top
R64  22  [RESISTOR_ARRAY_1206_4CH_CRA06S]  46.23,73.66 90 top
R65  DNP  [0603]  28.19,45.72 180 top
R66  100K  [0603]  36.45,49.78 0 top
R67  100K  [0603]  29.34,40.64 180 top
R68  22  [RESISTOR_ARRAY_1206_4CH_CRA06S]  52.7,44.45 90 top
R69  22  [RESISTOR_ARRAY_1206_4CH_CRA06S]  37.46,2.79 90 top
R70  1  [0805]  13.72,26.67 90 top
R71  1  [0805]  11.56,26.67 90 top
R72  DNP  [0603]  46.35,70.1 270 top
R73  1  [0805]  18.03,26.67 90 top
R74  100K  [0603]  46.48,67.18 270 top
R75  1  [0805]  15.88,26.67 90 top
R76  22  [RESISTOR_ARRAY_1206_4CH_CRA06S]  40.13,34.04 180 top
R77  22  [RESISTOR_ARRAY_1206_4CH_CRA06S]  37.46,18.29 90 top
R78  DNP  [0603]  32.38,45.72 180 top
R79  DNP  [0603]  32.38,47.62 180 top
R80  100K  [0603]  36.45,47.62 180 top
R81  DNP  [0603]  19.3,52.7 0 top
R82  100K  [0603]  29.34,36.83 0 top
R83  DNP  [0603]  37.08,84.33 270 top
R84  DNP  [0603]  28.19,47.62 0 top
R85  DNP  [0603]  20.32,67.82 0 top
R86  DNP  [0603]  20.32,70.36 0 top
R87  2K  [0603]  27.94,75.69 270 top
R88  33  [0805]  15.11,48.64 180 top
R89  33  [0805]  12.06,40.01 180 top
R90  20K  [0603]  14.73,55.12 180 top
R91  20K  [0603]  14.73,46.48 180 top
R92  330  [0603]  99.95,10.16 270 top
R93  330  [0603]  99.95,6.1 90 top
R94  DNP  [0603]  39.37,29.46 270 top
R95  2K  [0603]  39.62,84.33 90 top
R96  220  [0603]  104.78,8.13 270 top
R97  DNP  [0603]  31.5,32 90 top
R98  2K  [0805]  15.24,70.87 180 top
R99  2.2K  [RESISTOR_ARRAY_1206_4CH_CRA06S]  11.94,32.13 180 top
R100  220  [0603]  80.14,10.16 270 top
R101  1K  [0603]  11.56,87.25 0 top
R102  2K  [0805]  15.11,57.4 180 top
R103  10K  [0603]  31.5,28.83 270 top
R104  390  [0603]  87.25,15.24 90 top
R105  1K  [0603]  11.56,92.08 0 top
R106  1M  [0603]  19.3,48.64 0 top
R107  2K  [0603]  15.49,68.58 180 top
R108  2K  [0603]  15.49,63.5 180 top
R109  330  [0603]  102.49,10.16 90 top
R110  330  [0603]  102.49,6.1 270 top
R111  1K  [0603]  11.56,89.53 0 top
R112  10K  [0603]  19.3,46.1 0 top
R113  1K  [0603]  42.16,84.33 90 top
R114  2K  [0805]  15.24,81.79 180 top
R115  1K  [0603]  2.92,20.19 270 top
R116  DNP  [0603]  29.34,38.73 0 top
R117  1K  [0603]  20.57,32.51 270 top
R118  10K  [0603]  22.86,56.39 0 top
R119  1K  [0603]  1.4,20.19 270 top
R120  2K  [0805]  15.24,79.5 180 top
R121  1K  [0603]  4.44,20.19 270 top
R122  2K  [0603]  17.27,84.58 270 top
R123  2K  [0603]  15.49,73.15 180 top
R124  1K  [0603]  29.59,32 270 top
R125  10K  [0603]  19.3,56.52 0 top
SW1  SPST_TACT-EVQQ2  [EVQ-Q2]  80.14,89.53 180 top
SW2  ROTARY_ENCODER_SW_2CH_LED2XXS  [ROTARY_ENCODER_BOURNS_PEL12D]  4.95,90.81 180 top
SW3  ROTARY_ENCODER_SW_2CH_LED2XXS  [ROTARY_ENCODER_BOURNS_PEL12D]  4.95,29.84 180 top
T1  COMMON_MODE_CHOKEBIG_FOOT  [CM-CHOKE_PULSE_BIG-FOOT]  42.54,109.86 0 top
U1  LTC3854  [MSOP12+1]  114.81,117.73 270 top
U2  LTC2955TS8  [TSOT-23-8]  74.55,100.97 270 top
U3  LT3971  [MSOP10+1_LT]  96.14,94.87 90 top
U4  PAPILIO_PLUS_MEGAWING  [PAPILIO_PLUS]  74.93,40.01 180 bottom
U5  1.2V  [TSOT23]  97.16,73.03 180 top
U6  3.3V  [TSOT23]  58.8,67.95 90 top
U7  3.3V  [DPACK_1]  40,90.55 270 top
U8  3.3V  [DPACK_1]  117.47,85.72 180 top
U9  SN74HCT541DW  [SOIC-20_TI_DW]  119.13,68.07 270 top
U10  SN74HCT541DW  [SOIC-20_TI_DW]  119.13,45.97 270 top
U11  SN74HCT541DW  [SOIC-20_TI_DW]  119.13,24.89 270 top
U12  WT32  [WT32_BT_MODULE]  21.59,11.68 90 top
U13  TLV320AIC3106ZQE  [QFN48+1]  34.54,69.85 270 top
U14  ADC128S102  [TSSOP16]  36.83,40.26 180 top
U15  FLASH-SPI-25XXSMD1  [SO08-EIAJ]  90.8,44.45 0 top
U16  6N138SMD8  [SMD-8]  88.77,7.62 90 top
U17  3.3V  [TSOT23]  35.56,29.59 270 top
U18  OPA344  [SOT23-5]  22.73,52.2 180 top
U19  ITG-3200  [QFN-24]  53.97,78.74 90 top
U$6  [GADGETFACTORY_LOGO]  131.57,0.76 0 top